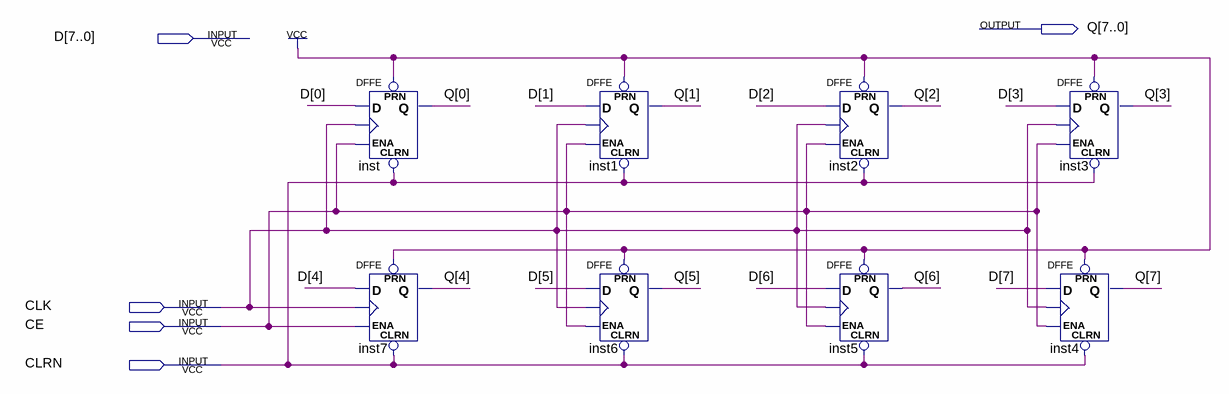
[diagram p0: schematic sheet]
// Quartus schematic dffe8bit.bdf as structural Verilog: 8 symbols, 5 pins
module dffe8bit (
  input  [7:0] D,
  input  CLK,
  input  CE,
  input  CLRN,
  output [7:0] Q
);

  DFFE inst (.PRN(1'b1), .CLRN(CLRN), .D(D[0]), .CLK(CLK), .ENA(CE), .Q(Q[0]));
  DFFE inst7 (.PRN(1'b1), .CLRN(CLRN), .D(D[4]), .CLK(CLK), .ENA(CE), .Q(Q[4]));
  DFFE inst1 (.PRN(1'b1), .CLRN(CLRN), .D(D[1]), .CLK(CLK), .ENA(CE), .Q(Q[1]));
  DFFE inst6 (.PRN(1'b1), .CLRN(CLRN), .D(D[5]), .CLK(CLK), .ENA(CE), .Q(Q[5]));
  DFFE inst2 (.PRN(1'b1), .CLRN(CLRN), .D(D[2]), .CLK(CLK), .ENA(CE), .Q(Q[2]));
  DFFE inst5 (.PRN(1'b1), .CLRN(CLRN), .D(D[6]), .CLK(CLK), .ENA(CE), .Q(Q[6]));
  DFFE inst3 (.PRN(1'b1), .CLRN(CLRN), .D(D[3]), .CLK(CLK), .ENA(CE), .Q(Q[3]));
  DFFE inst4 (.PRN(1'b1), .CLRN(CLRN), .D(D[7]), .CLK(CLK), .ENA(CE), .Q(Q[7]));
endmodule
